# Altium schematic sheet WiFi.SchDoc
size A4
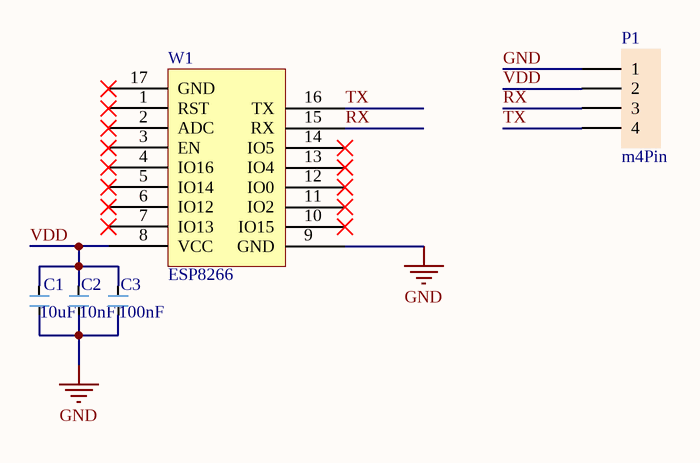
[diagram p0: WiFi.SchDoc]

## Parts
C1  10uF  [C0603]
C2  10nF  [C0603]
C3  100nF  [C0603]
P1  m4Pin  [4x1 header]
W1  ESP8266  [ESP-12S]

## Nets
GND: C1.1 C2.1 C3.1 P1.1 W1.9(GND)
RX: P1.3 W1.15(RX)
TX: P1.4 W1.16(TX)
VDD: C1.2 C2.2 C3.2 P1.2 W1.8(VCC)

Not connected (* = marked no-connect by the designer): W1 1(RST)* 2(ADC)* 3(EN)* 4(IO16)* 5(IO14)* 6(IO12)* 7(IO13)* 10(IO15)* 11(IO2)* 12(IO0)* 13(IO4)* 14(IO5)* 17(GND)*

## Library data of the parts
C1-C3 = C0603: 陶瓷电容
P1 = m4Pin: 1x4pin 1.27mm